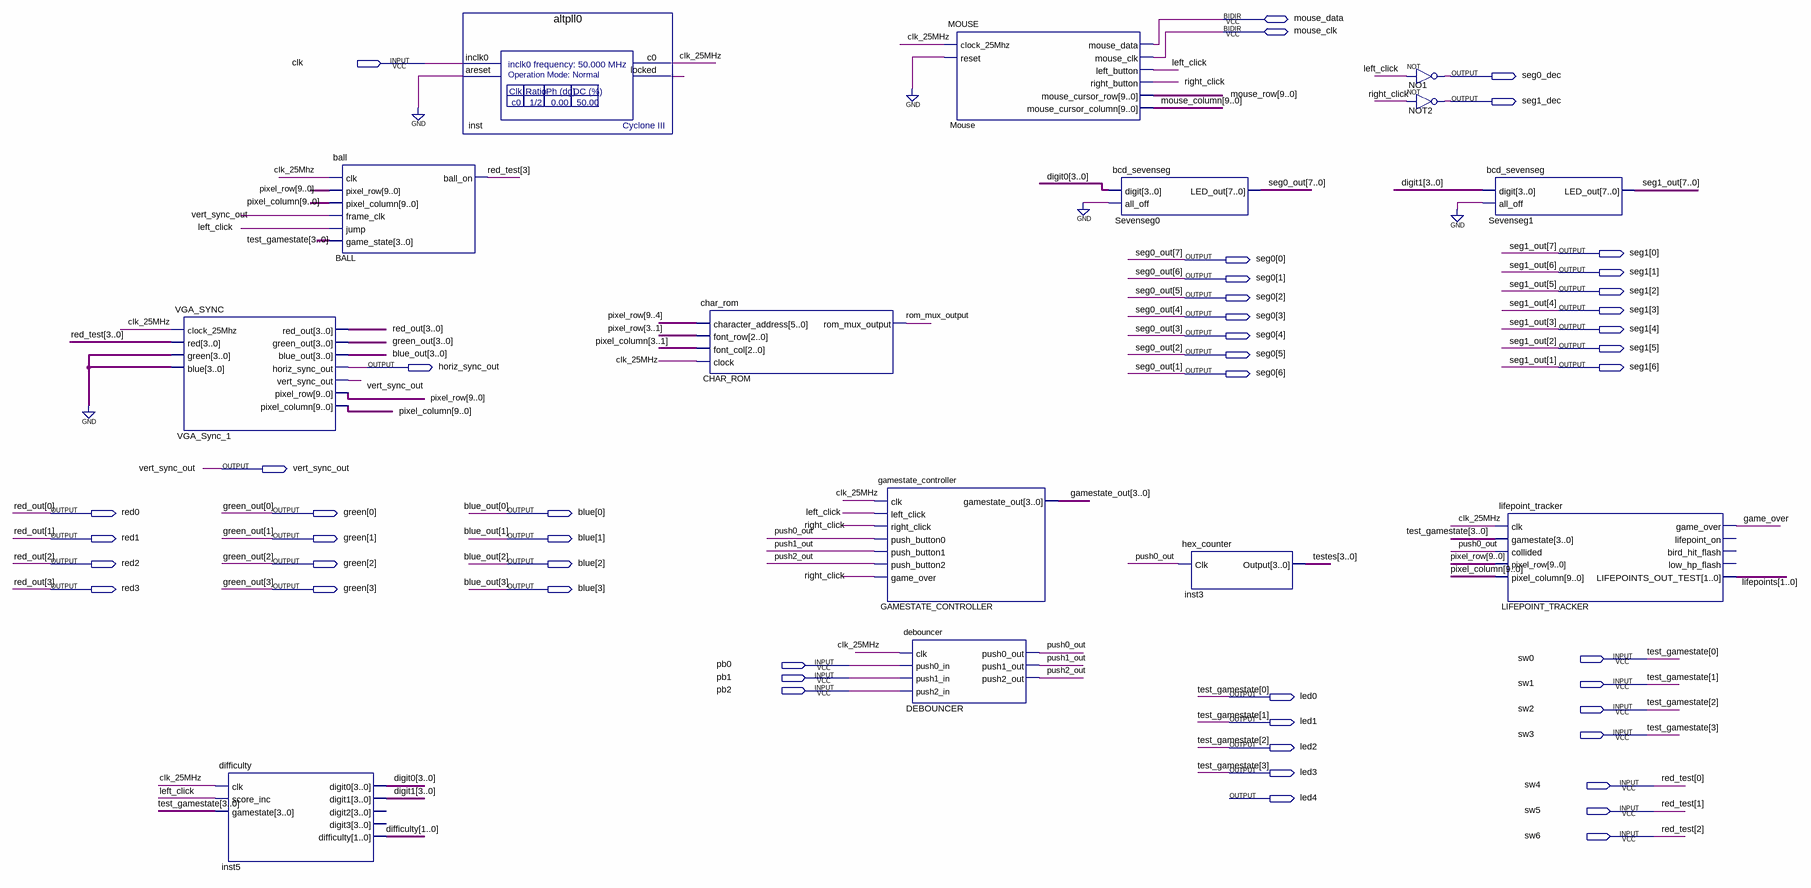
[diagram p0: schematic sheet]
// Quartus schematic 305_miniproject_Cecil.bdf as structural Verilog: 14 symbols, 48 pins
module \305_miniproject_Cecil  (
  input  clk,
  input  sw0,
  input  pb0,
  input  pb1,
  input  sw1,
  input  pb2,
  input  sw2,
  input  sw3,
  input  sw4,
  input  sw5,
  input  sw6,
  inout  mouse_data,
  inout  mouse_clk,
  output seg0_dec,
  output seg1_dec,
  output [6:0] seg1,
  output [6:0] seg0,
  output horiz_sync_out,
  output vert_sync_out,
  output red0,
  output [3:0] green,
  output [3:0] blue,
  output red1,
  output red2,
  output red3,
  output led0,
  output led1,
  output led2,
  output led3,
  output led4
);

  wire clk_25MHz, game_over, inst_locked, left_click, push0_out, push1_out, push2_out, right_click,
       rom_mux_output;
  wire [0:0] seg0_out, seg1_out;
  wire [1:0] difficulty, lifepoints;
  wire [3:0] digit0, digit1, gamestate_out, testes;
  wire [3:3] red_test;
  wire [9:0] mouse_column, mouse_row, pixel_column, pixel_row;

  VGA_SYNC VGA_Sync_1 (
    .clock_25Mhz(clk_25MHz), .red({red_test[3], sw6, sw5, sw4}), .green(4'b0000), .blue(4'b0000),
    .red_out({red3, red2, red1, red0}), .green_out(green), .blue_out(blue), .horiz_sync_out(horiz_sync_out),
    .vert_sync_out(vert_sync_out), .pixel_row(pixel_row), .pixel_column(pixel_column));
  difficulty inst5 (
    .clk(clk_25MHz), .score_inc(left_click), .gamestate({sw3, sw2, sw1, sw0}), .digit0(digit0),
    .digit1(digit1), .difficulty(difficulty));  // open: digit2, digit3
  ball BALL (
    .clk(clk_25MHz), .pixel_row(pixel_row), .pixel_column(pixel_column), .frame_clk(vert_sync_out),
    .jump(left_click), .game_state({sw3, sw2, sw1, sw0}), .ball_on(red_test[3]));
  altpll0 inst (.inclk0(clk), .areset(1'b0), .c0(clk_25MHz), .locked(inst_locked));
  char_rom CHAR_ROM (
    .character_address(pixel_row[9:4]), .font_row(pixel_row[3:1]), .font_col(pixel_column[3:1]),
    .clock(clk_25MHz), .rom_mux_output(rom_mux_output));
  gamestate_controller GAMESTATE_CONTROLLER (
    .clk(clk_25MHz), .left_click(left_click), .right_click(right_click), .push_button0(push0_out),
    .push_button1(push1_out), .push_button2(push2_out), .game_over(right_click), .gamestate_out(gamestate_out));
  MOUSE Mouse (
    .clock_25Mhz(clk_25MHz), .reset(1'b0), .left_button(left_click), .right_button(right_click),
    .mouse_cursor_row(mouse_row), .mouse_cursor_column(mouse_column), .mouse_data(mouse_data),
    .mouse_clk(mouse_clk));
  debouncer DEBOUNCER (
    .clk(clk_25MHz), .push0_in(pb0), .push1_in(pb1), .push2_in(pb2), .push0_out(push0_out),
    .push1_out(push1_out), .push2_out(push2_out));
  bcd_sevenseg Sevenseg0 (
    .digit(digit0), .all_off(1'b0),
    .LED_out({seg0[0], seg0[1], seg0[2], seg0[3], seg0[4], seg0[5], seg0[6], seg0_out[0]}));
  hex_counter inst3 (.Clk(push0_out), .Output(testes));
  not NO1 (seg0_dec, left_click);
  not NOT2 (seg1_dec, right_click);
  bcd_sevenseg Sevenseg1 (
    .digit(digit1), .all_off(1'b0),
    .LED_out({seg1[0], seg1[1], seg1[2], seg1[3], seg1[4], seg1[5], seg1[6], seg1_out[0]}));
  lifepoint_tracker LIFEPOINT_TRACKER (
    .clk(clk_25MHz), .gamestate({sw3, sw2, sw1, sw0}), .collided(push0_out), .pixel_row(pixel_row),
    .pixel_column(pixel_column), .game_over(game_over), .LIFEPOINTS_OUT_TEST(lifepoints));  // open: lifepoint_on, bird_hit_flash, low_hp_flash

  assign led0 = sw0;
  assign led1 = sw1;
  assign led2 = sw2;
  assign led3 = sw3;

  // Other names for the same wires on the sheet: blue_out[3:0] = blue; green_out[3:0] = green;
  //   red_out[3:0] = {red3, red2, red1, red0}; red_test[2:0] = {sw6, sw5, sw4};
  //   seg0_out[7:1] = {seg0[0], seg0[1], seg0[2], seg0[3], seg0[4], seg0[5], seg0[6]};
  //   seg1_out[7:1] = {seg1[0], seg1[1], seg1[2], seg1[3], seg1[4], seg1[5], seg1[6]};
  //   test_gamestate[3:0] = {sw3, sw2, sw1, sw0}
endmodule
